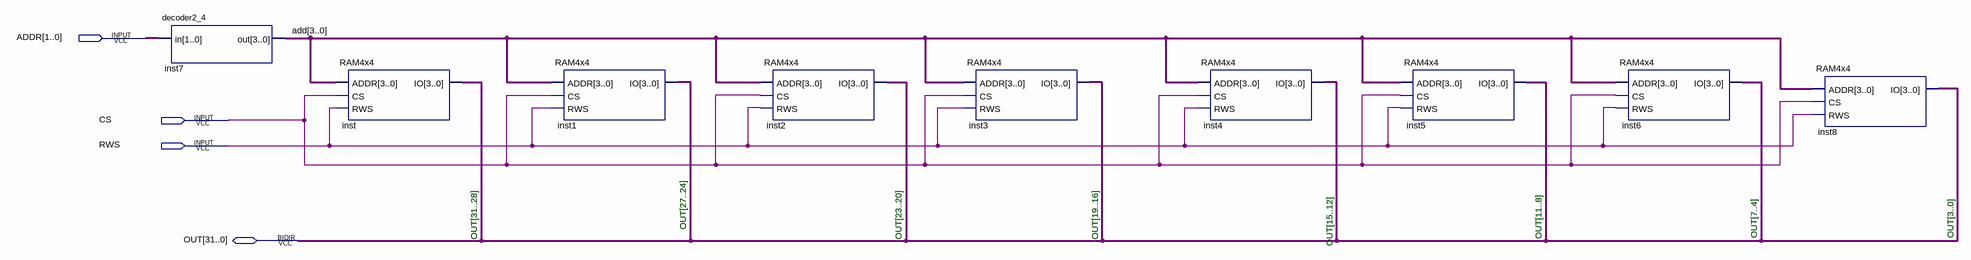
[diagram p0: schematic sheet]
// Quartus schematic RAM4x32.bdf as structural Verilog: 9 symbols, 4 pins
module RAM4x32 (
  input  [1:0] ADDR,
  input  CS,
  input  RWS,
  inout  [31:0] OUT
);

  wire [3:0] add;

  decoder2_4 inst7 (.in(ADDR), .out(add));
  RAM4x4 inst (.ADDR(add), .CS(CS), .RWS(RWS), .IO(OUT[31:28]));
  RAM4x4 inst1 (.ADDR(add), .CS(CS), .RWS(RWS), .IO(OUT[27:24]));
  RAM4x4 inst2 (.ADDR(add), .CS(CS), .RWS(RWS), .IO(OUT[23:20]));
  RAM4x4 inst3 (.ADDR(add), .CS(CS), .RWS(RWS), .IO(OUT[19:16]));
  RAM4x4 inst4 (.ADDR(add), .CS(CS), .RWS(RWS), .IO(OUT[15:12]));
  RAM4x4 inst5 (.ADDR(add), .CS(CS), .RWS(RWS), .IO(OUT[11:8]));
  RAM4x4 inst6 (.ADDR(add), .CS(CS), .RWS(RWS), .IO(OUT[7:4]));
  RAM4x4 inst8 (.ADDR(add), .CS(CS), .RWS(RWS), .IO(OUT[3:0]));

  // Notes on the sheet:
  //   OUT[27..24]
  //   OUT[31..28]
  //   OUT[23..20]
  //   OUT[19..16]
  //   OUT[11..8]
  //   OUT[15..12]
  //   OUT[7..4]
  //   OUT[3..0]
endmodule
